# Altium schematic sheet PD_TRIGGER.SchDoc: =DocumentName
size A4; CompanyName: "AS Manufacturing" LLC; Organization: "AS Manufacturing" LLC; Address1: 5 Sklyarenka St.; Address2: Kyiv 04073; Address3: Ukraine; Address4: https://ajax.systems/en/; DocumentNumber: 6; SheetNumber: 6; SheetTotal: 7; Template_version: 1.0.1
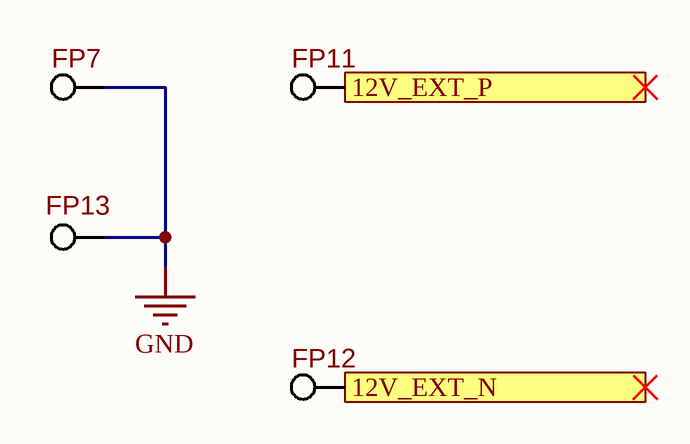
[diagram p0: PD_TRIGGER.SchDoc]

## Parts
FP7  PAD-1.45mm  [PAD-1.45mm]  (value not drawn)  (no BOM)
FP11  PAD-1.45mm  [PAD-1.45mm]  (value not drawn)  (no BOM)
FP12  PAD-1.45mm  [PAD-1.45mm]  (value not drawn)  (no BOM)
FP13  PAD-1.45mm  [PAD-1.45mm]  (value not drawn)  (no BOM)

## Ports
12V_EXT_N, 12V_EXT_P

## Nets
GND: FP7.1 FP13.1
12V_EXT_N: FP12.1 ; port 12V_EXT_N
12V_EXT_P: FP11.1 ; port 12V_EXT_P

## Notes on the sheet
- Title
- Product:
- Project:
- Size:
- Date:
- Variant:
- A4
- Authors:
- Time:
- Sheet
- of
- Revision:
- @Vitech_ua
- Commit:

## Library data of the parts
FP7 FP11-FP13 = PAD-1.45mm: 1.45mm Pad for Plug-In or Receptacle; Ajax_1C_PN: NONE; Ajax_1С_Status: RND Only; Component Status: Released; Part Number: PAD-1.45mm; Component Type: PTH; Manufacturer: NONE; Part Type: Pad; Temperature Range: NONE; ComponentLink1URL: NONE; Replacement: NONE; Price: NONE; ComponentLink1Description: Datasheet